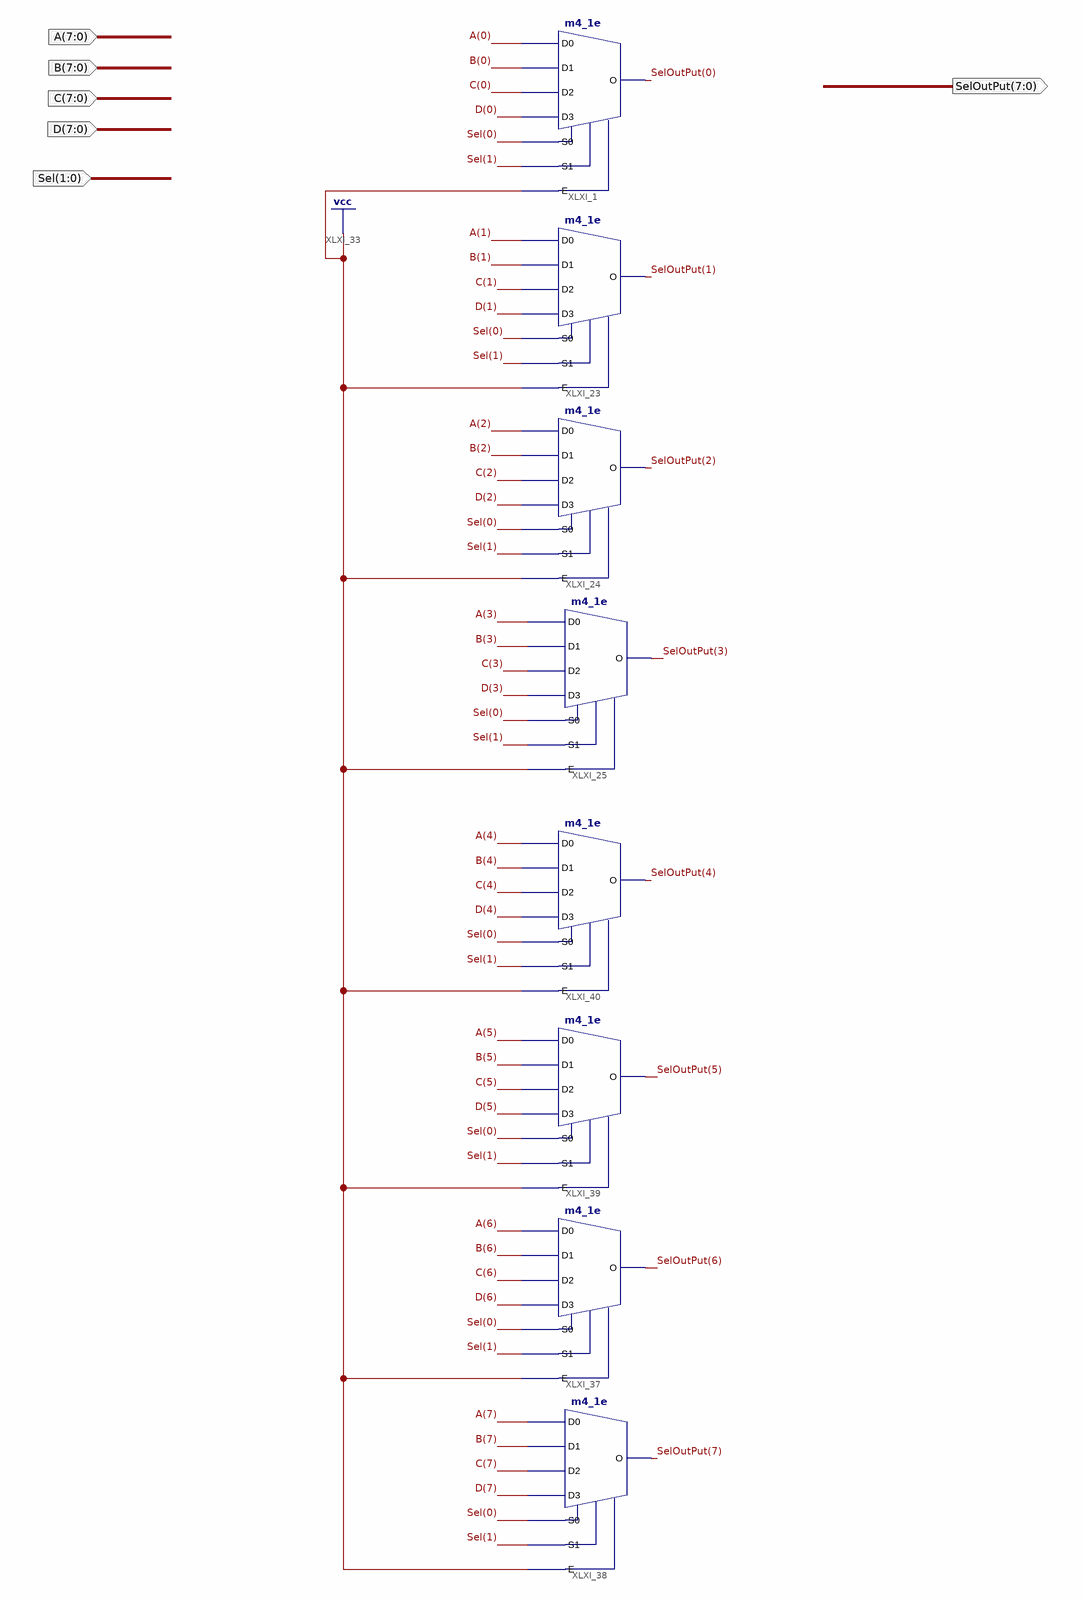
[diagram p0: schematic sheet 1]
// Xilinx ISE schematic ModeSelector.sch (spartan6) as structural Verilog: 8 symbols, 6 ports
module ModeSelector (
  input  [1:0] Sel,
  input  [7:0] D,
  input  [7:0] C,
  input  [7:0] B,
  input  [7:0] A,
  output [7:0] SelOutPut
);

  m4_1e XLXI_23 (.D0(A[1]), .D1(B[1]), .D2(C[1]), .D3(D[1]), .E(1'b1), .S0(Sel[0]), .S1(Sel[1]), .O(SelOutPut[1]));
  m4_1e XLXI_24 (.D0(A[2]), .D1(B[2]), .D2(C[2]), .D3(D[2]), .E(1'b1), .S0(Sel[0]), .S1(Sel[1]), .O(SelOutPut[2]));
  m4_1e XLXI_25 (.D0(A[3]), .D1(B[3]), .D2(C[3]), .D3(D[3]), .E(1'b1), .S0(Sel[0]), .S1(Sel[1]), .O(SelOutPut[3]));
  m4_1e XLXI_1 (.D0(A[0]), .D1(B[0]), .D2(C[0]), .D3(D[0]), .E(1'b1), .S0(Sel[0]), .S1(Sel[1]), .O(SelOutPut[0]));
  m4_1e XLXI_37 (.D0(A[6]), .D1(B[6]), .D2(C[6]), .D3(D[6]), .E(1'b1), .S0(Sel[0]), .S1(Sel[1]), .O(SelOutPut[6]));
  m4_1e XLXI_38 (.D0(A[7]), .D1(B[7]), .D2(C[7]), .D3(D[7]), .E(1'b1), .S0(Sel[0]), .S1(Sel[1]), .O(SelOutPut[7]));
  m4_1e XLXI_39 (.D0(A[5]), .D1(B[5]), .D2(C[5]), .D3(D[5]), .E(1'b1), .S0(Sel[0]), .S1(Sel[1]), .O(SelOutPut[5]));
  m4_1e XLXI_40 (.D0(A[4]), .D1(B[4]), .D2(C[4]), .D3(D[4]), .E(1'b1), .S0(Sel[0]), .S1(Sel[1]), .O(SelOutPut[4]));
endmodule
